# Altium schematic sheet Temperature and Fan.SchDoc
size A3; SheetNumber: 5; SheetTotal: 5
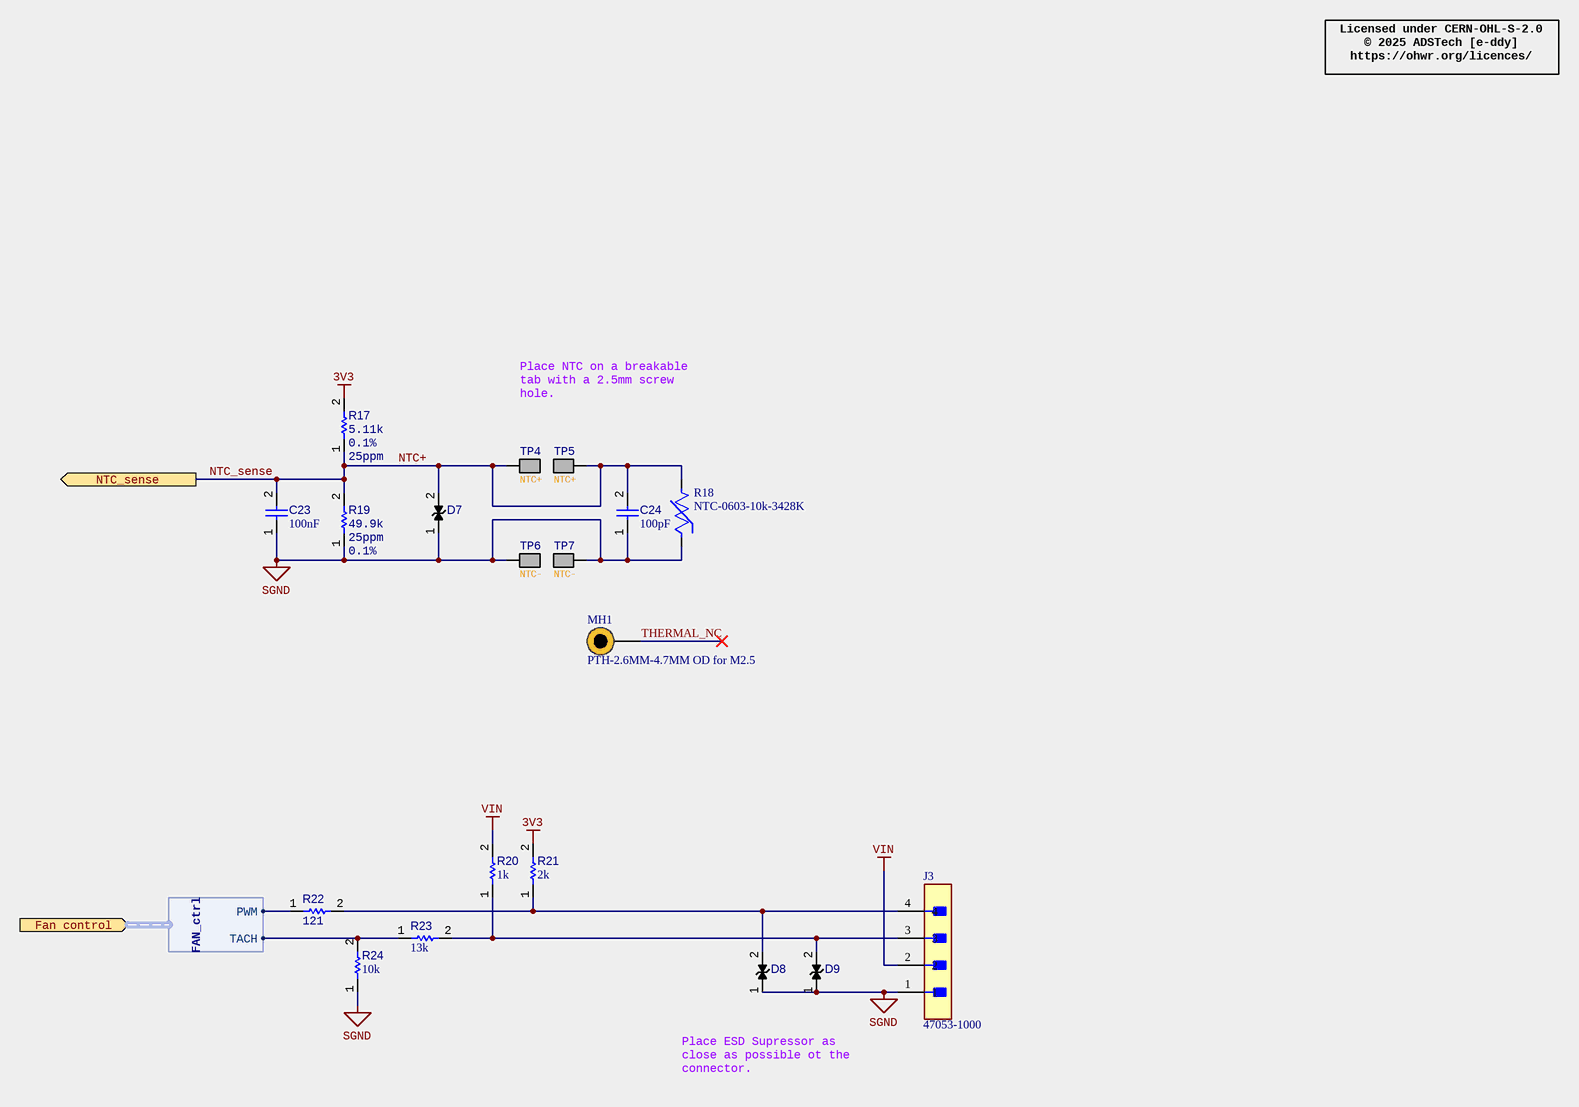
[diagram p0: Temperature and Fan.SchDoc]

## Parts
C23  value 100nF  [CAP_0402-IPC_B]  (hidden comment: C-0402-CER-X7R-100nF-10%-50V)
C24  value 100pF  [CAP_0402-IPC_B]  (hidden comment: C-0402-C0G-100pF-50V-1%)
D7  ESD-0603ESDA-MLP1  [CAP-0603-IPC_B]  (value not drawn)
D8  ESD-0603ESDA-MLP1  [CAP-0603-IPC_B]  (value not drawn)
D9  ESD-0603ESDA-MLP1  [CAP-0603-IPC_B]  (value not drawn)
J3  47053-1000  [FP-470531000-MFG]
MH1  PTH-2.6MM-4.7MM OD for M2.5  [PTH-2.6MM-4.7MM]  (net tie, no BOM)
R17  value 5.11k  Tolerance: 0.1%  TCR: 25ppm  [RES-0402-IPC_B]  (hidden comment: R-0402-5110.0-0.1%-25ppm-0.016)
R18  NTC-0603-10k-3428K  [FP-NCU18-0_15-MFG]
R19  value 49.9k  TCR: 25ppm  Tolerance: 0.1%  [RES-0402-IPC_B]  (hidden comment: R-0402-49900.0-0.1%-25ppm-0.016)
R20  value 1k  [RES-0402-IPC_B]  (hidden comment: R-0402-1000.0-1%-100ppm-0.5)
R21  value 2k  [RES-0402-IPC_B]  (hidden comment: R-0402-2000.0-1%-100ppm-0.5)
R22  value 121  [RES-0402-IPC_B]  (hidden comment: R-0402-121.0-1%-100ppm-0.5)
R23  value 13k  [RES-0402-IPC_B]  (hidden comment: R-0402-13000.0-1%-100ppm-0.5)
R24  value 10k  [RES-0402-IPC_B]  (hidden comment: R-0402-10000.0-1%-100ppm-0.5)
TP4  Name: NTC+  [3x2 pad]  (hidden comment: SMT-PAD-3x2)  (no BOM)
TP5  Name: NTC+  [3x2 pad]  (hidden comment: SMT-PAD-3x2)  (no BOM)
TP6  Name: NTC-  [3x2 pad]  (hidden comment: SMT-PAD-3x2)  (no BOM)
TP7  Name: NTC-  [3x2 pad]  (hidden comment: SMT-PAD-3x2)  (no BOM)

## Ports
Fan control (in, harness FAN_ctrl, see Block diagram[3C], MCU[1B]), NTC_sense (out, see Block diagram[3C], MCU[2C])

## Harnesses
FAN_ctrl: PWM, TACH

## Nets
3V3: R17.2 R21.2
SGND: C23.1 C24.1 D7.1(K) D8.1(K) D9.1(K) J3.1 R18.1 R19.1 R24.1 TP6.1 TP7.1
VIN: J3.2 R20.2
NTC+: C23.2 C24.2 D7.2(A) R17.1 R18.2 R19.2 TP4.1 TP5.1 ; port NTC_sense  [also labelled NTC_sense]
THERMAL_NC: MH1.0
NetD8_2: D8.2(A) J3.4 R21.1 R22.2
NetD9_2: D9.2(A) J3.3 R20.1 R23.2
NetR22_1: R22.1 ; port Fan control.PWM
NetR23_1: R23.1 R24.2 ; port Fan control.TACH

## Notes on the sheet
- Licensed under CERN-OHL-S-2.0
  © 2025 ADSTech [e-ddy]
  https://ohwr.org/licences/
- Place NTC on a breakable tab with a 2.5mm screw hole.
- Place ESD Supressor as close as possible ot the connector.
- Size
- A3
- CCA No.
- Sheet:
- of
- Rev

## Library data of the parts
C23 = CMP-001-00003-5: Multilayer Ceramic Capacitor, 0.1 uF, 50 V, ± 10%, X7R, 0402 [1005 Metric]; Voltage Rating: 50V; Package Quantity: 50000; Pins: 2; Case Code (Imperial): 0402; RoHS Compliant: Yes; Voltage Rating (DC): 50V; Series: GRM; Max Operating Temperature: 125°C; Dielectric: X7R; Length: 0.039inch; Packaging: Tape and Reel; Thickness: 0.022inch; Material: Ceramic; Mounting Technology: Surface Mount; Tolerance: 10%; Lead Free: Lead Free; Case Code (Metric): 1005; Case/Package: 0402; Width: 0.02inch; Termination: SMD/SMT; Weight: 0.000212oz; Min Operating Temperature: -55°C; Height: 0.5mm
C24 = CMP-00082-3: Multilayer Ceramic Capacitors MLCC - SMD/SMT 50V 100pF C0G 0402 +/-1%; Tolerance: 1%; Package: 0402; Dielectric: C0G
D7-D9 = CMP-004-00006-1: Suppressor Esd 0.05PF 0603 SMD
J3 = CMP-04776-000290-2: CONN HEADER VERT 4POS 2.54MM; NexarPartId: 854935; Manufacturer Lifecycle Status: ACTIVE; Voltage Rating (DC): 250V; Gender: Male; Plating: Copper; Number of Positions: 4; Glow Wire Compliant: Non-compliant; Current Rating: 500mA; Max Operating Temperature: 75°C; Number of Rows: 1; REACH SVHC: Unknown; Ambient Temperature Range High: 105°C; Pitch: 2.54mm; Height: 7.7mm; Min Operating Temperature: 0°C; Packaging: Bulk; Contact Material: Brass, Copper; Contact Plating: Tin; Lead Pitch: 2.54mm; Voltage Rating: 250V; Termination: Through Hole; Radiation Hardening: No; Orientation: Vertical; Mount: Through Hole; Number of Pins: 4; Country of Origin: HK; Halogen Free: Low Halogen; Lifecycle Status: Production; Number of Circuits: 4; Schedule B: 8536694040, 8536694040; Housing Color: Beige; Housing Material: Nylon; Depth: 5.84mm; RoHS: Compliant; Length: 10.2mm; Number of Contacts: 4
MH1 = CMP-015-000007-1: 2.6mm/4.7mm PLATED TROUGH HOLE. For M2.5 Cylindrical hex screw head
R17 = RES-0402-00549-3: 0402 5110.0 Ω 0.1% 25ppm 0.016W Resistor; Power: 16mW; Package: 0402
R18 = CMP-010-00000-1: NTC Thermistor, 10000ohm, Surface Mount; Reference Standard: AEC-Q200; Power: 100mW; Thermistor Application: TEMPERATURE COMPENSATION; Value: 10kR; Tolerance: 1%; Rated Temperature: 25°C; Max Operating Temperature: 150°C; Resistor Type: NTC THERMISTOR; Pins: 2; RoHS Compliant: Yes; Terminal Placement: Dual Ended; Reach SVHC Compliant: Yes; Min Operating Temperature: -40°C; Termination: Wraparound; Mounting Technology: Surface Mount; Package Shape: Rectangular; Packaging: Tape and Reel
R19 = RES-0402-00644-3: 0402 49900.0 Ω 0.1% 25ppm 0.016W Resistor; Power: 16mW; Package: 0402
R20 = RES-0402-00192-5: 0402 1000.0 Ω 1% 100ppm 0.063W Resistor; MPN: CRCW04021K00FKED; Power: 63mW; TCR: 100ppm; Tolerance: 1%; Package: 0402
R21 = RES-0402-00221-5: 0402 2000.0 Ω 1% 100ppm 0.063W Resistor; MPN: CRCW04022K00FKED; Power: 63mW; TCR: 100ppm; Package: 0402; Tolerance: 1%
R22 = RES-0402-00104-5: 0402 121.0 Ω 1% 100ppm 0.063W Resistor; MPN: CRCW0402121RFKED; Power: 63mW; Package: 0402; Tolerance: 1%; TCR: 100ppm
R23 = RES-0402-00299-5: 0402 13000.0 Ω 1% 100ppm 0.063W Resistor; MPN: CRCW040213K0FKED; Power: 63mW; Tolerance: 1%; TCR: 100ppm; Package: 0402
R24 = RES-0402-00288-6: 0402 10000.0 Ω 1% 100ppm 0.063W Resistor; MPN: RC0402FR-0710KL; Power: 63mW; TCR: 100ppm; Package: 0402; Tolerance: 1%
TP4-TP7 = CMP-00096-1: 3x2mm standard pad for wire soldering